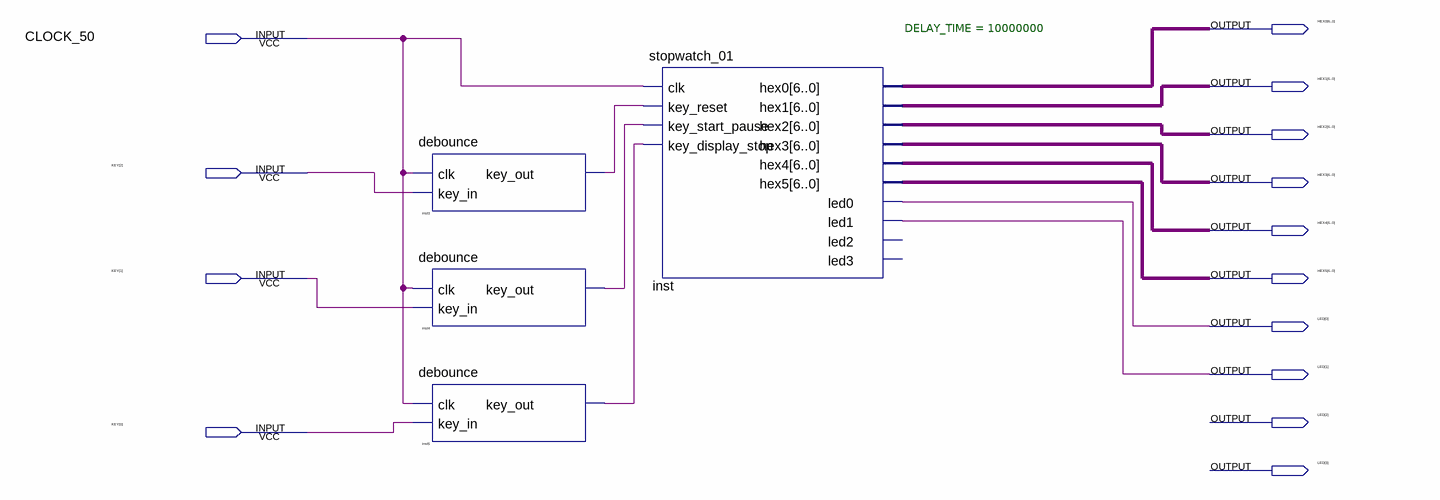
[diagram p0: schematic sheet]
// Quartus schematic stopwatch.bdf as structural Verilog: 4 symbols, 14 pins
module stopwatch (
  input  CLOCK_50,
  input  [2:0] KEY,
  output [6:0] HEX0,
  output [6:0] HEX1,
  output [6:0] HEX2,
  output [6:0] HEX3,
  output [6:0] HEX4,
  output [6:0] HEX5,
  output [3:0] LED
);

  wire inst3_key_out, inst4_key_out, inst5_key_out;

  debounce inst3 (.clk(CLOCK_50), .key_in(KEY[2]), .key_out(inst3_key_out));
  debounce inst4 (.clk(CLOCK_50), .key_in(KEY[1]), .key_out(inst4_key_out));
  debounce inst5 (.clk(CLOCK_50), .key_in(KEY[0]), .key_out(inst5_key_out));
  stopwatch_01 #(.DELAY_TIME(10000000)) inst (
    .clk(CLOCK_50), .key_reset(inst3_key_out), .key_start_pause(inst4_key_out),
    .key_display_stop(inst5_key_out), .hex0(HEX0), .hex1(HEX1), .hex2(HEX2), .hex3(HEX3), .hex4(HEX4),
    .hex5(HEX5), .led0(LED[0]), .led1(LED[1]));  // open: led2, led3
endmodule
